# EAGLE design untitled (EAGLE 6.4)
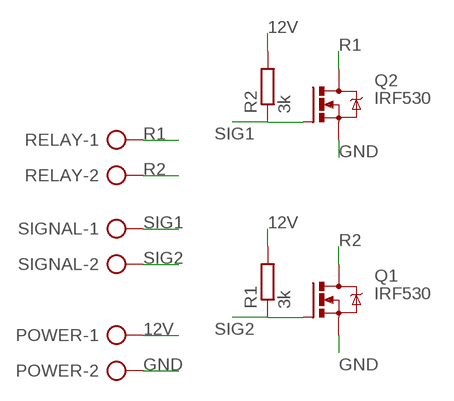
[diagram p0: schematic, sheet 1]

## Parts
POWER  AK300/2  [AK300/2]
Q1  IRF530  [TO220BV]
Q2  IRF530  [TO220BV]
R1  3k  R-EU_0204/7  [0204/7]
R2  3k  R-EU_0204/7  [0204/7]
RELAY  AK300/2  [AK300/2]
SIGNAL  AK300/2  [AK300/2]

## Nets
12V: POWER.1 R1.2 R2.2
GND: POWER.2 Q1.S Q2.S
R1: Q2.D RELAY.1
R2: Q1.D RELAY.2
SIG1: Q2.G R2.1 SIGNAL.1
SIG2: Q1.G R1.1 SIGNAL.2

## Library data of the parts
POWER RELAY SIGNAL = con-ptr500:AK300/2: CONNECTOR; OC_FARNELL: unknown; OC_NEWARK: unknown
Q1 Q2 = transistor-power:IRF530: HEXFET Power MOSFET
R1 R2 = resistor:R-EU_: RESISTOR, European symbol

## Board
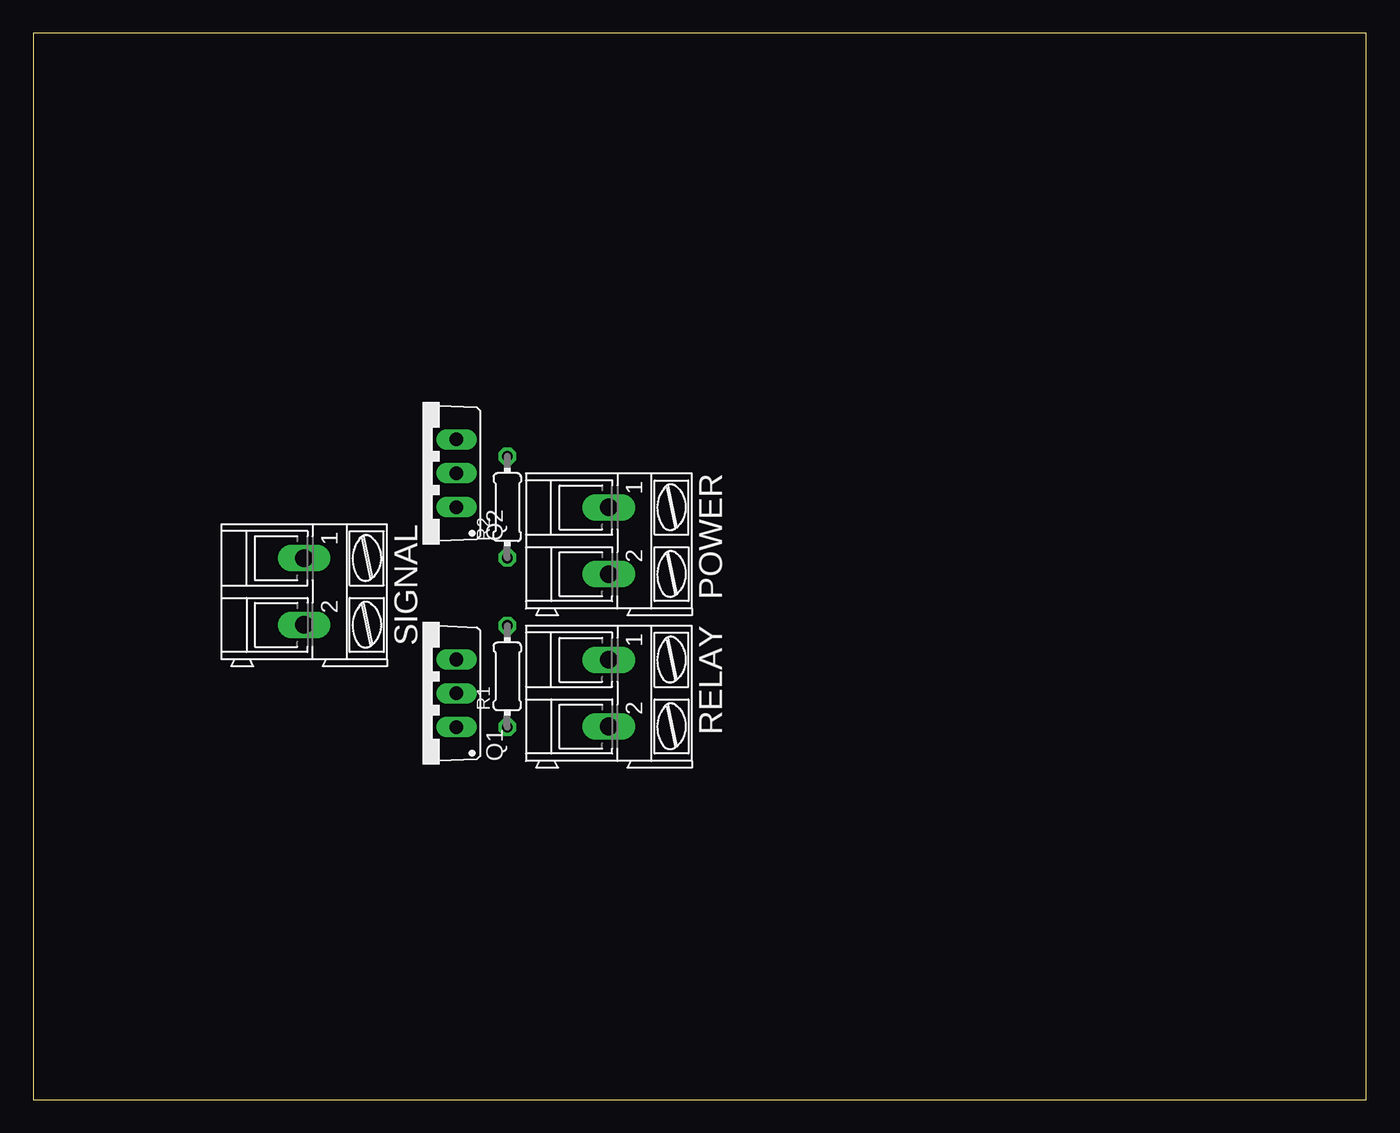
[diagram p1: board, top side]
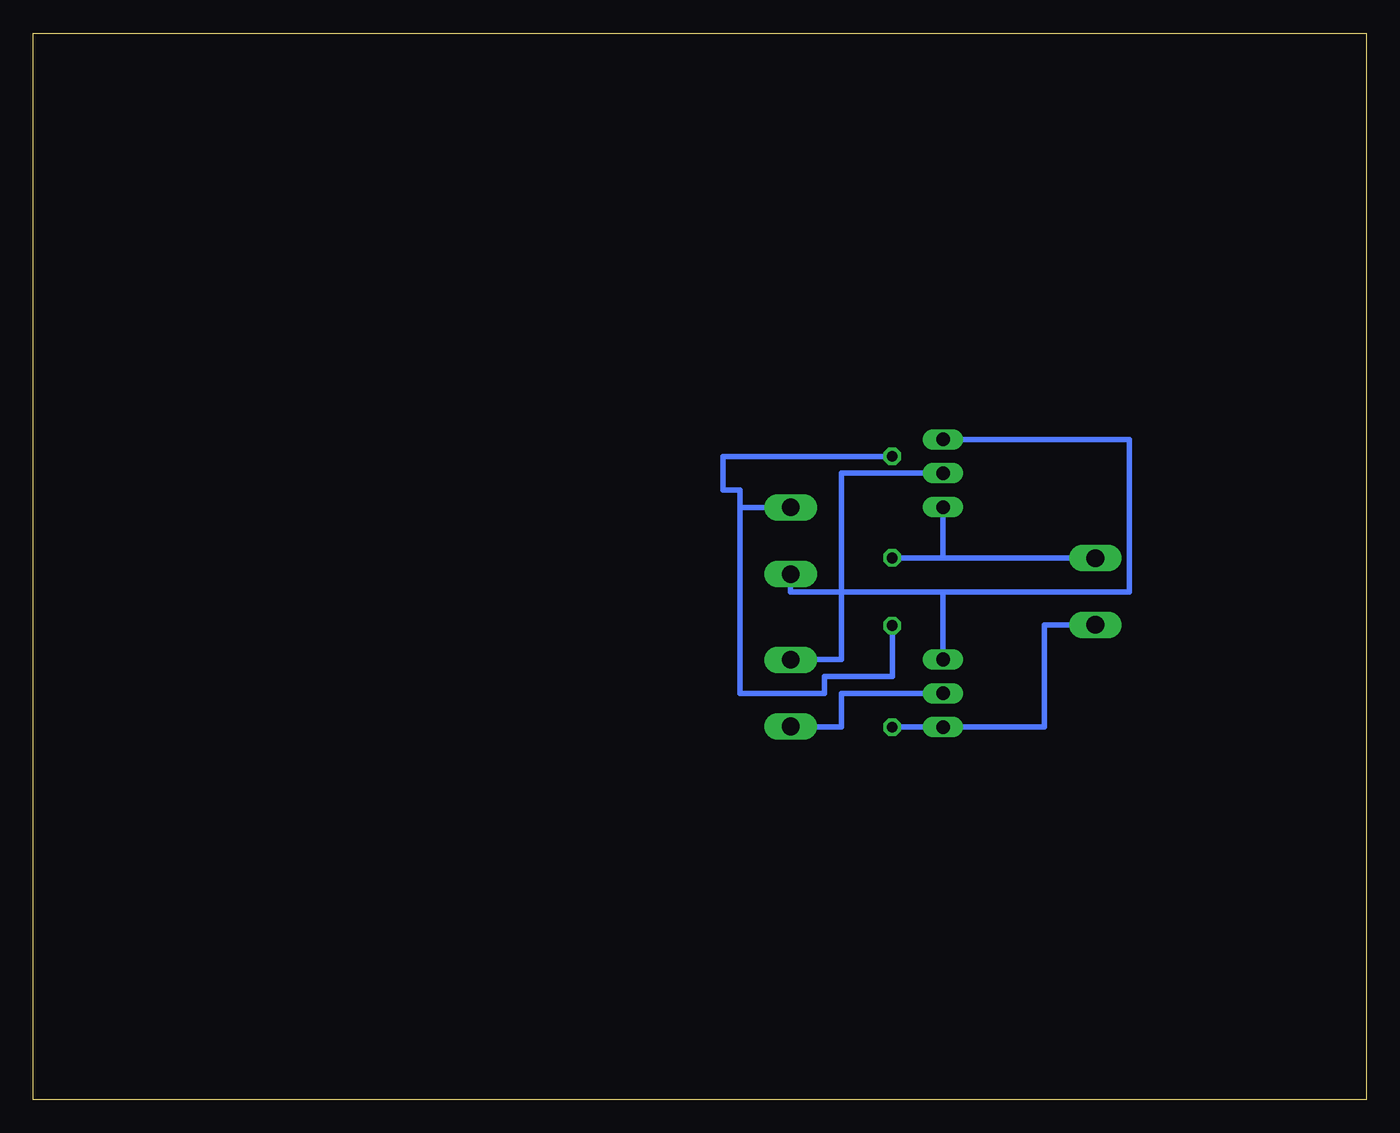
[diagram p2: board, bottom side, seen from below]

Size 100 x 80 mm. Coordinates in mm from the lower left corner, seen from the top.
Outline: 0,0 100,0 100,80 0,80 0,0
Copper layers (1*16): Top 0.035mm / dielectric 1.5mm / Bottom 0.035mm
Design rules "default": minimum track width 10mil, minimum drill 24mil, track to track 8mil, track to pad 8mil, pad to pad 8mil, via to via 8mil, smd to smd 8mil, copper to edge 40mil, drill to drill 8mil, minimum pad ring 10mil, minimum via ring 8mil, stop-mask expansion 4mil, vias tented up to drill 0mil, thermal gap 10mil

### Footprints (pad centres in the part's own frame; a part is rotated, then mirrored left to right if it is on the bottom)
AK300/2 = drill 1.321 long: 1 -2.515,0; 2 2.489,0
TO220BV = drill 1.016 long: D 0,-2.54; G -2.54,-2.54; S 2.54,-2.54
0204/7 = drill 0.813 octagon: 1 -3.81,0; 2 3.81,0

### Placement (x,y rotation side)
POWER  43.18,41.91 270 top
Q1  29.21,30.48 90 top
Q2  29.21,46.99 90 top
R1  35.56,31.75 90 top
R2  35.56,44.45 90 top
RELAY  43.18,30.48 270 top
SIGNAL  20.32,38.1 270 top

### Tracks (layer width: path | path; a pad name or v marks a point on that pad's centre or on a via)
12V
  Bottom 0.406: R2.2 48.26,48.26 48.26,45.72 46.99,45.72 46.99,44.45 46.99,44.42 | 46.99,44.42 46.99,30.48 40.64,30.48 40.64,31.75 35.56,31.75 R1.2 | POWER.1 46.99,44.42
GND
  Bottom 0.406: Q2.S 17.78,49.53 17.78,38.1 31.75,38.1 | 31.75,38.1 43.18,38.1 POWER.2 | Q1.S 31.75,38.1
R1
  Bottom 0.406: Q2.D 39.37,46.99 39.37,33.02 43.18,33.02 RELAY.1
R2
  Bottom 0.406: Q1.D 39.37,30.48 39.37,27.94 43.18,27.94 RELAY.2
SIG1
  Bottom 0.406: R2.1 31.75,40.64 | 31.75,40.64 Q2.G | SIGNAL.1 31.75,40.62 31.75,40.64
SIG2
  Bottom 0.406: R1.1 Q1.G 24.13,27.94 24.13,35.61 SIGNAL.2